# EAGLE design can4vscp_rs232_rev_A (EAGLE 5.11)
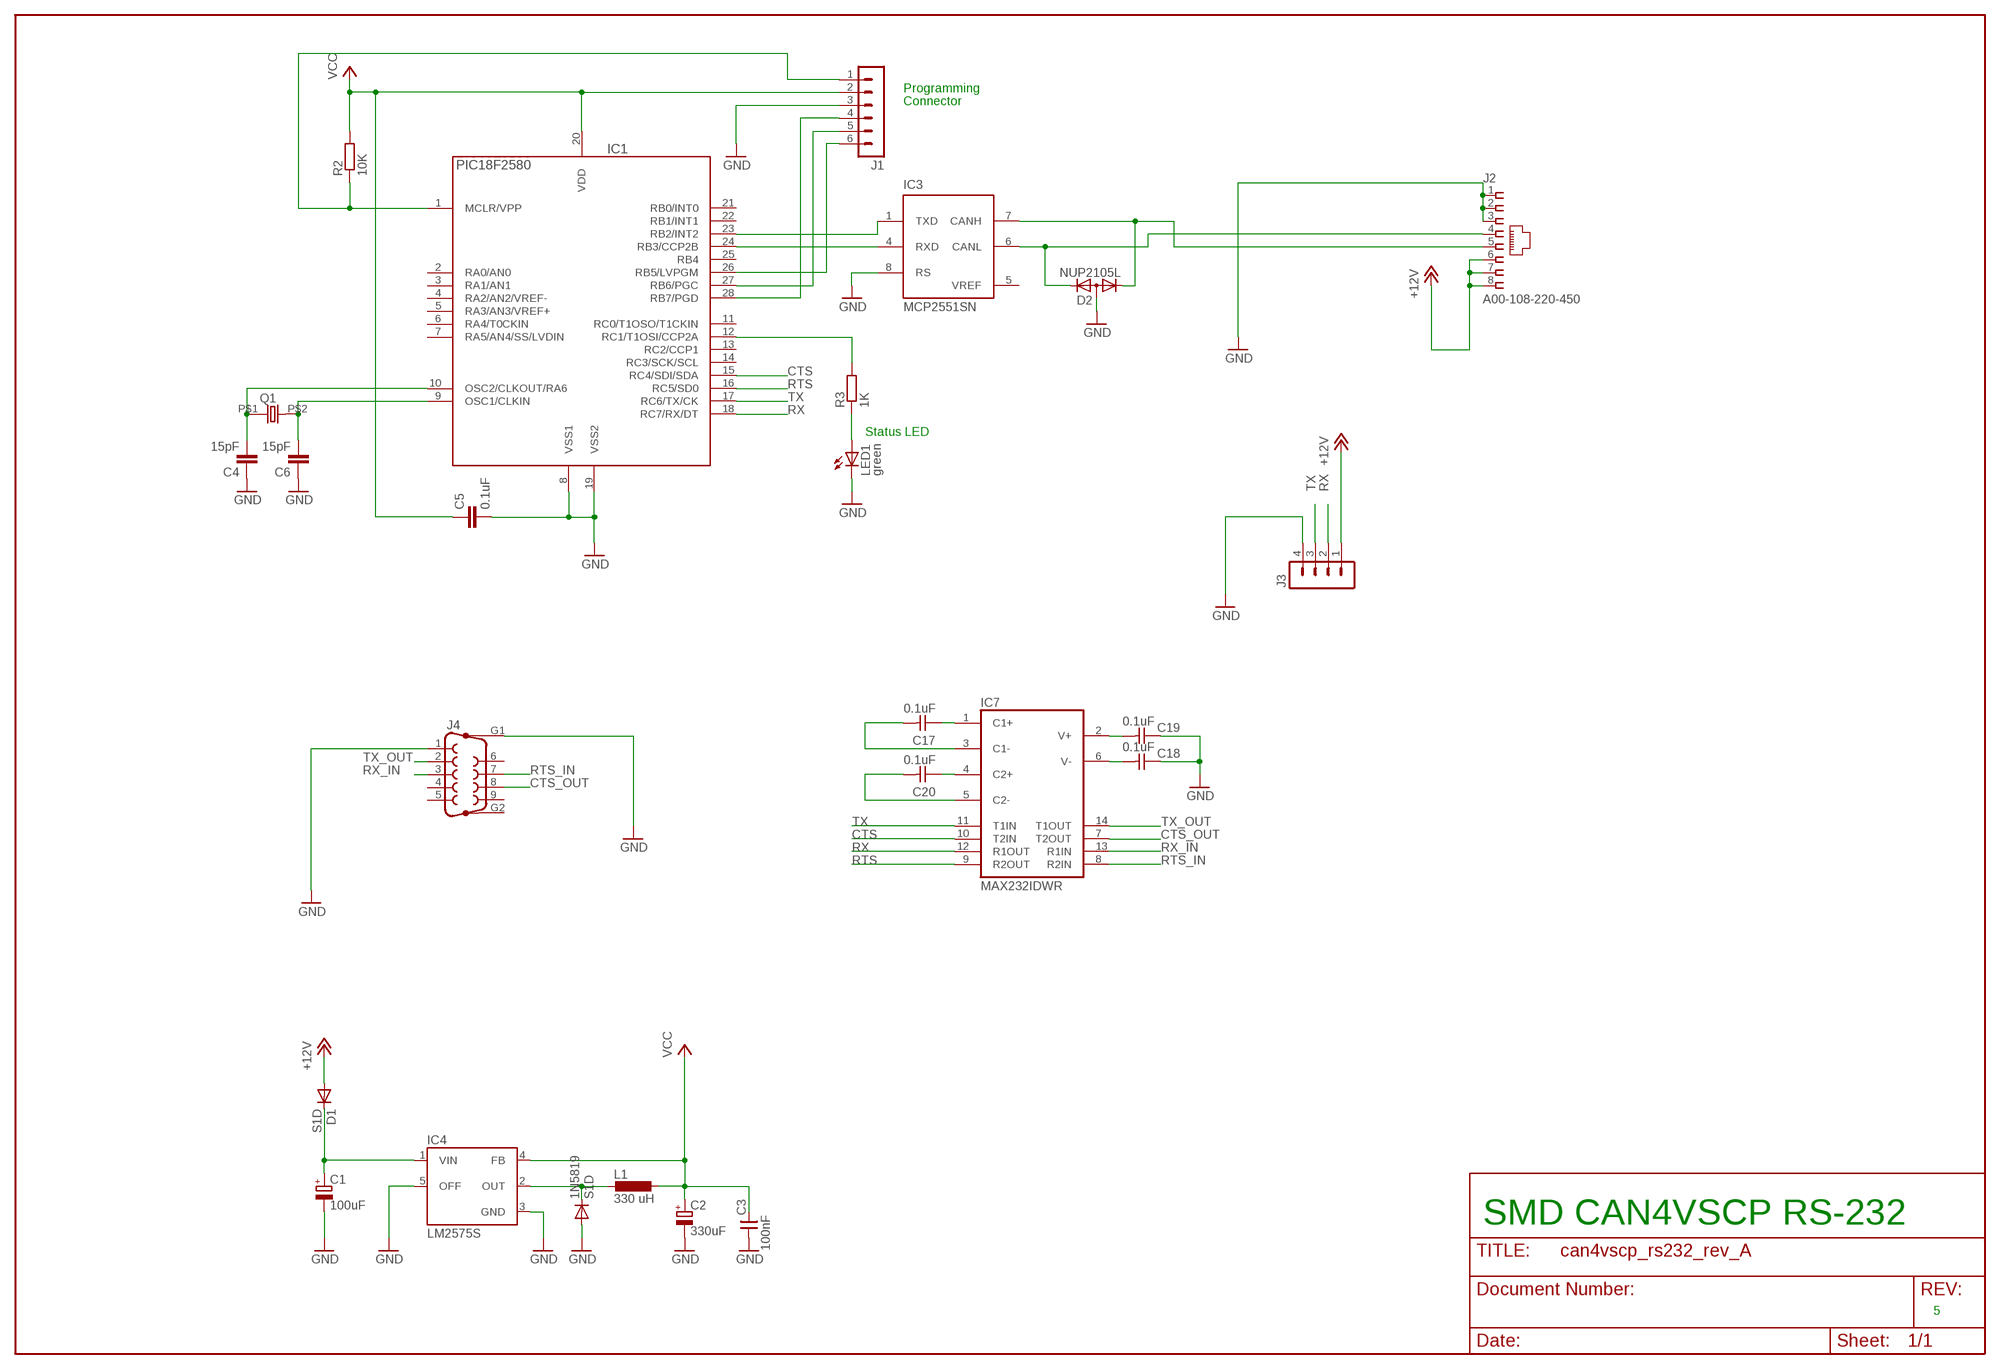
[diagram p0: schematic, sheet 1]

## Parts
1N5819  S1D  DIODE-SMB  [SMB]
C1  100uF  CPOL-EUD  [PANASONIC_D]
C2  330uF  CPOL-EUD  [PANASONIC_D]
C3  100nF  CNP-0805  [0805]
C4  15pF  C-EUC0805  [C0805]
C5  0.1uF  C-EUC0805  [C0805]
C6  15pF  C-EUC0805  [C0805]
C17  0.1uF  NP_CAP0805  [C0805]
C18  0.1uF  NP_CAP0805  [C0805]
C19  0.1uF  NP_CAP0805  [C0805]
C20  0.1uF  NP_CAP0805  [C0805]
D1  S1D  DIODE-SMB  [SMB]
D2  NUP2105L  DIODE-2CA|ACSOT23  [SOT23]
IC1  PIC18F2580  PIC18LF252-I/SO  [SO28]
IC3  MCP2551SN  [SO-08]
IC4  LM2575S  [TO263-5]
IC7  MAX232IDWR  MAX232ECWE  [SO16L]
J1  MA06-1  [MA06-1]
J2  A00-108-220-450  [RJ-45]
J3  MA04-1  [MA04-1]
J4  F09HP  [F09HP]
L1  330 uH  DO3316P  [DO3316P]
LED1  green  LEDCHIPLED_0805  [CHIPLED_0805]
Q1  HC-49S  [9C]
R2  10K  R-EU_R0805  [R0805]
R3  1K  R-EU_R0805  [R0805]

## Nets
+12V: D1.A J2.6 J2.7 J2.8 J3.1
CANH: D2.1(K1) IC3.7(CANH) J2.5
CANL: D2.2(K2) IC3.6(CANL) J2.4
CTS: IC1.15(RC4/SDI/SDA) IC7.10(T2IN)
CTS_OUT: IC7.7(T2OUT) J4.8
GND: 1N5819.A C1.- C2.- C3.1 C4.1 C5.2 C6.1 C18.1 C19.1 D2.3(A) IC1.8(VSS1) IC1.19(VSS2) IC3.8(RS) IC4.3(GND) IC4.5(OFF) J1.3 J2.1 J2.2 J2.3 J3.4 J4.1 J4.G1 LED1.C
N$1: 1N5819.C IC4.2(OUT) L1.1
N$2: C4.2 IC1.10(OSC2/CLKOUT/RA6) Q1.P$1
N$3: C1.+ D1.C IC4.1(VIN)
N$4: IC1.12(RC1/T1OSI/CCP2A) R3.2
N$5: LED1.A R3.1
N$7: C6.2 IC1.9(OSC1/CLKIN) Q1.P$2
N$12: IC1.1(MCLR/VPP) J1.1 R2.1
N$13: IC1.28(RB7/PGD) J1.4
N$14: IC1.27(RB6/PGC) J1.5
N$15: IC1.26(RB5/LVPGM) J1.6
N$19: C17.1 IC7.1(C1+)
N$21: C17.2 IC7.3(C1-)
N$22: C20.1 IC7.4(C2+)
N$23: C20.2 IC7.5(C2-)
N$28: C19.2 IC7.2(V+)
N$30: C18.2 IC7.6(V-)
RTS: IC1.16(RC5/SD0) IC7.9(R2OUT)
RTS_IN: IC7.8(R2IN) J4.7
RX: IC1.18(RC7/RX/DT) IC7.12(R1OUT) J3.2
RX_IN: IC7.13(R1IN) J4.3
RXCAN: IC1.24(RB3/CCP2B) IC3.4(RXD)
TX: IC1.17(RC6/TX/CK) IC7.11(T1IN) J3.3
TX_OUT: IC7.14(T1OUT) J4.2
TXCAN: IC1.23(RB2/INT2) IC3.1(TXD)
VCC: C2.+ C3.2 C5.1 IC1.20(VDD) IC4.4(FB) J1.2 L1.2 R2.2
Unconnected: IC1.2(RA0/AN0) IC1.3(RA1/AN1) IC1.4(RA2/AN2/VREF-) IC1.5(RA3/AN3/VREF+) IC1.6(RA4/T0CKIN) IC1.7(RA5/AN4/SS/LVDIN) IC1.11(RC0/T1OSO/T1CKIN) IC1.13(RC2/CCP1) IC1.14(RC3/SCK/SCL) IC1.21(RB0/INT0) IC1.22(RB1/INT1) IC1.25(RB4) J4.4 J4.5 J4.6 J4.9 J4.G2

## Notes on the sheet
- Programming
- Connector
- Status LED
- SMD CAN4VSCP RS-232
- 5

## Power pins joined to a net without a drawn wire
GND: IC3.2(VSS) IC7.15(GND)
VCC: IC3.3(VDD) IC7.16(VCC)
VREF: IC3.5(VREF)

## Library data of the parts
1N5819 D1 = diode:DIODE-: DIODE
C1 C2 = rcl:CPOL-EU: POLARIZED CAPACITOR, European symbol
C3 = cap-master:CNP-: NON-POLARIZED CAP
C4-C6 = rcl:C-EU: CAPACITOR, European symbol
C17-C20 = Leicester:NP_CAP0805
D2 = diode:DIODE-2CA|AC: Dual DIODE Cathode-Anode|Anode-Cathode
IC1 = pic_olin:PIC18*F252-?: 18F252, 28 pin, 32Kb prog, 1536 data, 256 EEPROM
IC3 = microchip_can:MCP2551: High Speed CAN tranceiver
IC4 = v-reg-3:LM2575: National Semiconductor <http://www.national.com> 1.0A "Simple Switcher"(c) 52kHz, Vout 1.23-37V (HV: 57V), Vin 40V (HV: 60V), 50µA standby current
IC7 = maxim:MAX232ECWE: RS232 TRANSEIVER
J1 = con-lstb:MA06-1
J2 = vscpcan:A00-108-220-450
J3 = con-lstb:MA04-1: PIN HEADER; OC_FARNELL: unknown; OC_NEWARK: unknown
J4 = con-subd:F09HP: SUB-D
L1 = inductor-coilcraft:DO3316P: COILCRAFT
LED1 = led:LED: LED OSRAM: - CHIPLED LG R971, LG N971, LY N971, LG Q971, LY Q971, LO R971, LY R971 LH N974, LH R974 LS Q976, LO Q976, LY Q976 LO Q996 - Hyper CHIPLED LW Q18S LB Q993, LB Q99A, LB R99A - SideLED LS A670, LO A670, LY A670, LG A670, LP A670 LB A673, LV A673, LT A673, LW A673 LH A674 LY A675 LS A676, LA A676, LO A676, LY A676, LW A676 LS A679, LY A679, LG A679 - Hyper Micro SIDELED® LS Y876, LA Y876, LO Y876, LY Y876 LT Y87S - SmartLED LW L88C, LW L88S LB L89C, LB L89S, LG L890 LS L89K, LO L89K, LY L89K LS L896, LA L896, LO L896, LY L896 - TOPLED LS T670, LO T670, LY T670, LG T670, LP T670 LSG T670, LSP T670, LSY T670, LOP T670, LYG T670 LG T671, LOG T671, LSG T671 LB T673, LV T673, LT T673, LW T673 LH T674 LS T676, LA T676, LO T676, LY T676, LB T676, LH T676, LSB T676, LW T676 LB T67C, LV T67C, LT T67C, LS T67K, LO T67K, LY T67K, LW E67C LS E67B, LA E67B, LO E67B, LY E67B, LB E67C, LV E67C, LT E67C LW T67C LS T679, LY T679, LG T679 LS T770, LO T770, LY T770, LG T770, LP T770 LB T773, LV T773, LT T773, LW T773 LH T774 LS E675, LA E675, LY E675, LS T675 LS T776, LA T776, LO T776, LY T776, LB T776 LHGB T686 LT T68C, LB T68C - Hyper Mini TOPLED® LB M676 - Mini TOPLED Santana® LG M470 LS M47K, LO M47K, LY M47K Source: http://www.osram.convergy.de LUXEON: - LUMILED® LXK2-PW12-R00, LXK2-PW12-S00, LXK2-PW14-U00, LXK2-PW14-V00 LXK2-PM12-R00, LXK2-PM12-S00, LXK2-PM14-U00 LXK2-PE12-Q00, LXK2-PE12-R00, LXK2-PE12-S00, LXK2-PE14-T00, LXK2-PE14-U00 LXK2-PB12-K00, LXK2-PB12-L00, LXK2-PB12-M00, LXK2-PB14-N00, LXK2-PB14-P00, LXK2-PB14-Q00 LXK2-PR12-L00, LXK2-PR12-M00, LXK2-PR14-Q00, LXK2-PR14-R00 LXK2-PD12-Q00, LXK2-PD12-R00, LXK2-PD12-S00 LXK2-PH12-R00, LXK2-PH12-S00 LXK2-PL12-P00, LXK2-PL12-Q00, LXK2-PL12-R00 Source: www.luxeon.com KINGBRIGHT: KA-3528ASYC Source: www.kingbright.com
Q1 = vscpcan:HC-49S: Digikey 887-1050-1-nd
R2 R3 = rcl:R-EU_: RESISTOR, European symbol

## Board
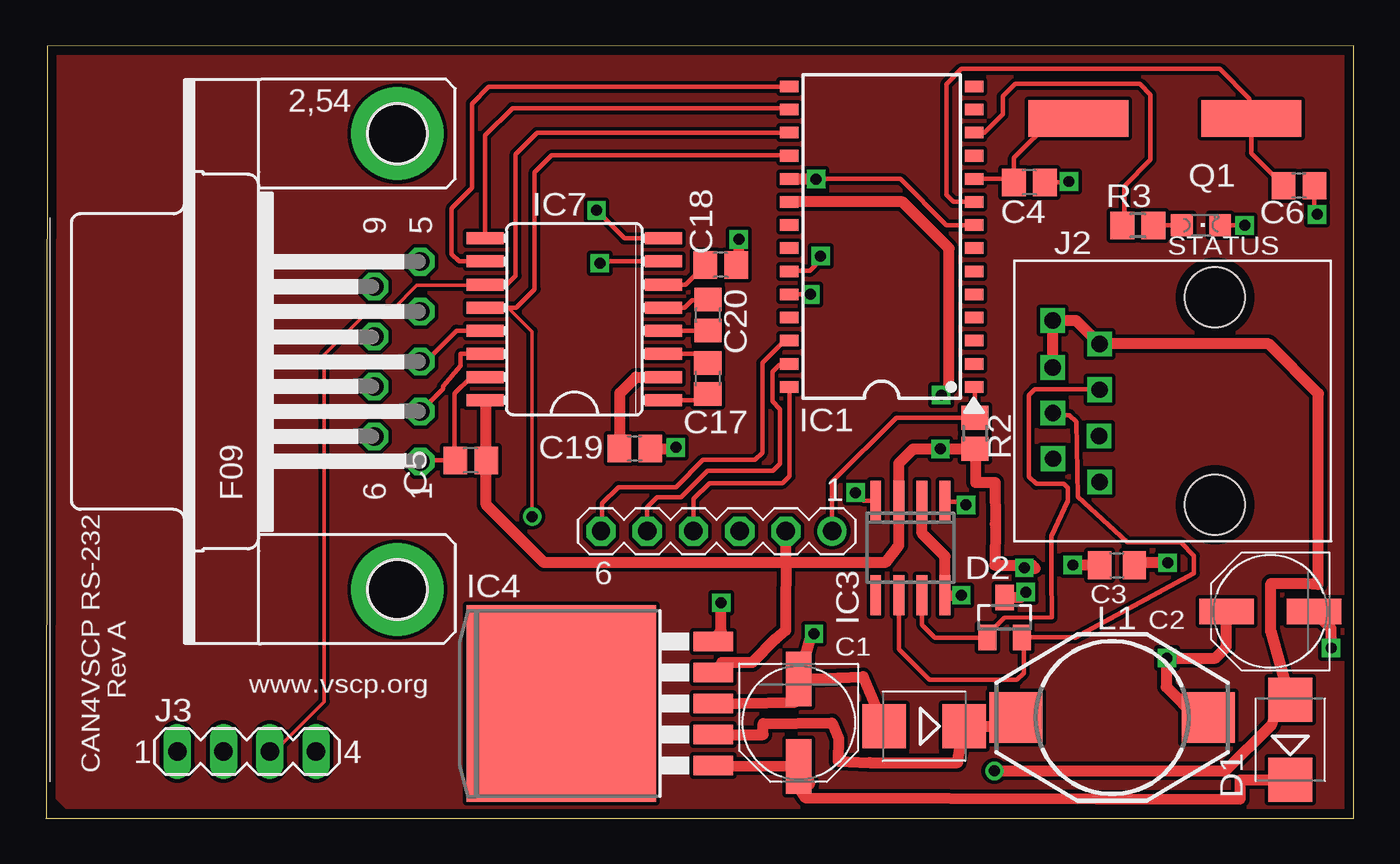
[diagram p1: board, top side]
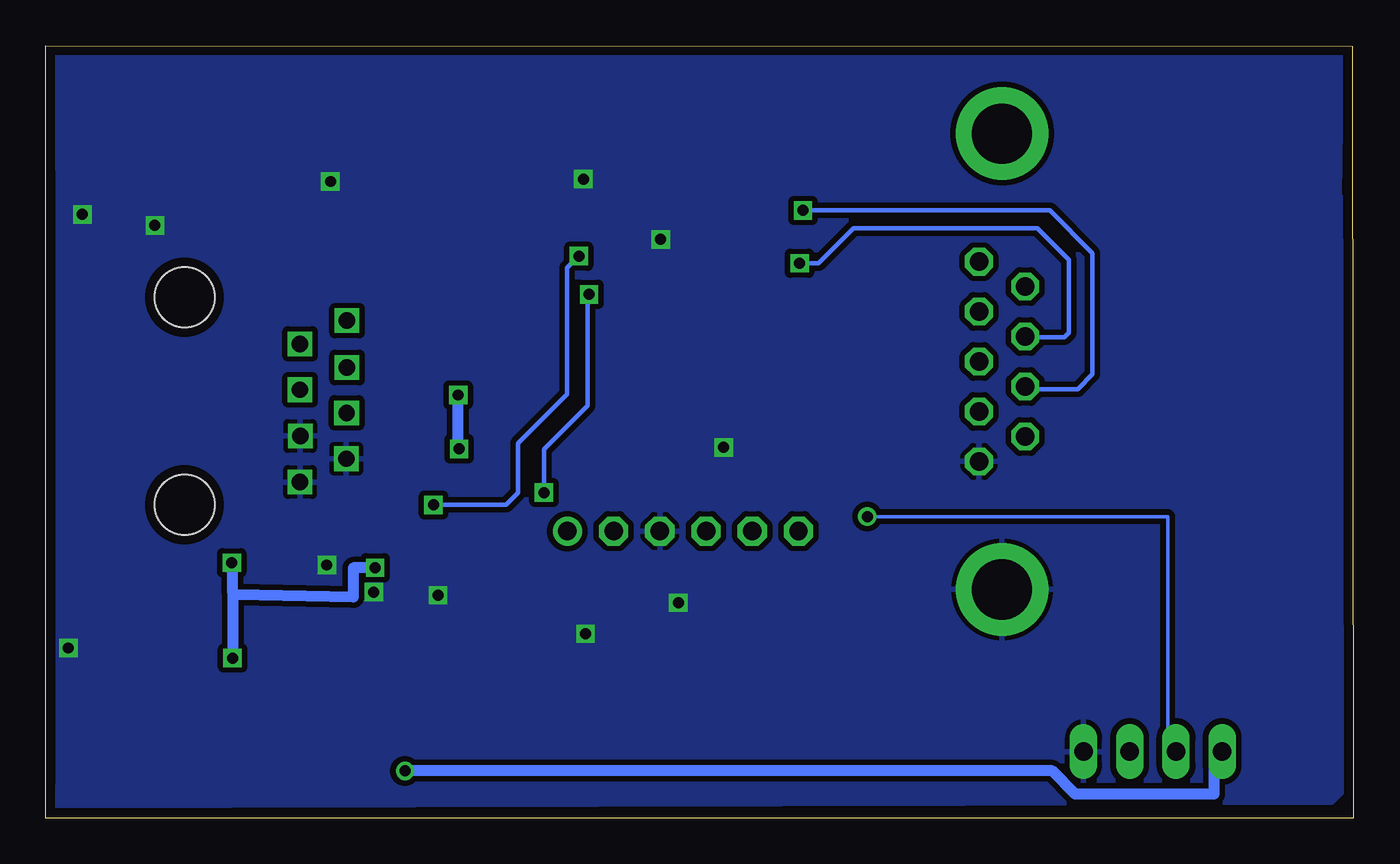
[diagram p2: board, bottom side, seen from below]

Size 71.91 x 42.44 mm. Coordinates in mm from the lower left corner, seen from the top.
Outline: 0,0 71.91,0 71.91,42.44 0.09,42.39 0.04,0.01
Copper layers (1*16): Top 0.035mm / dielectric 1.5mm / Bottom 0.035mm
Design rules "8mils": minimum track width 8mil, minimum drill 0.6mm, track to track 8mil, track to pad 8mil, pad to pad 8mil, via to via 8mil, smd to smd 0mil, copper to edge 20mil, drill to drill 10mil, minimum pad ring 8mil, minimum via ring 8mil, stop-mask expansion 0mil, vias tented up to drill 0mil, thermal gap 10mil

### Footprints (pad centres in the part's own frame; a part is rotated, then mirrored left to right if it is on the bottom)
SMB = smd 2.4 x 2.4: A 2.2,0; C -2.2,0
PANASONIC_D = smd 3 x 1.4: + 2.4,0; - -2.4,0
0805 = smd 1.27 x 1.524: 1 -0.953,0; 2 0.953,0
C0805 = smd 1.3 x 1.5: 1 -0.85,0; 2 0.85,0
SOT23 = smd 1 x 1.4: 1 -0.95,-1.1; 2 0.95,-1.1; 3 0,1.1
SO28 = smd 0.635 x 1.016: 1 -8.255,-5.08; 2 -6.985,-5.08; 3 -5.715,-5.08; 4 -4.445,-5.08; 5 -3.175,-5.08; 6 -1.905,-5.08; 7 -0.635,-5.08; 8 0.635,-5.08; 9 1.905,-5.08; 10 3.175,-5.08; 11 4.445,-5.08; 12 5.715,-5.08; 13 6.985,-5.08; 14 8.255,-5.08; 15 8.255,5.08; 16 6.985,5.08; 17 5.715,5.08; 18 4.445,5.08; 19 3.175,5.08; 20 1.905,5.08; 21 0.635,5.08; 22 -0.635,5.08; 23 -1.905,5.08; 24 -3.175,5.08; 25 -4.445,5.08; 26 -5.715,5.08; 27 -6.985,5.08; 28 -8.255,5.08
SO-08 = smd 0.6 x 2.2: 1 -1.905,-2.6; 2 -0.635,-2.6; 3 0.635,-2.6; 4 1.905,-2.6; 5 1.905,2.6; 6 0.635,2.6; 7 -0.635,2.6; 8 -1.905,2.6
TO263-5 = smd 1.067 x 2.159: 1 -3.404,-5.791; 2 -1.702,-5.791; 3 0,-5.791; 4 1.702,-5.791; 5 3.404,-5.791 | smd 10.8 x 10.41: 6 0,2.54
SO16L = smd 0.66 x 2.032: 1 -4.445,-4.902; 2 -3.175,-4.902; 3 -1.905,-4.902; 4 -0.635,-4.902; 5 0.635,-4.902; 6 1.905,-4.902; 7 3.175,-4.902; 8 4.445,-4.902; 9 4.445,4.902; 10 3.175,4.902; 11 1.905,4.902; 12 0.635,4.902; 13 -0.635,4.902; 14 -1.905,4.902; 15 -3.175,4.902; 16 -4.445,4.902
MA06-1 = drill 1.016 pad 1.6 round: 1 -6.35,0 | drill 1.016 pad 1.6 octagon: 2 -3.81,0; 3 -1.27,0; 4 1.27,0; 5 3.81,0; 6 6.35,0
RJ-45 = drill 0.9 square: 1 -4.45,6.35; 2 -3.17,8.89; 3 -1.92,6.36; 4 -0.65,8.91; 5 0.62,6.35; 6 1.84,8.93; 7 3.14,6.35; 8 4.42,8.93 | hole 3.3: -5.7,0; 5.7,0
MA04-1 = drill 1.016 long: 1 -3.81,0; 2 -1.27,0; 3 1.27,0; 4 3.81,0
F09HP = drill 1.016 octagon: 1 -5.486,-1.27; 2 -2.743,-1.27; 3 0,-1.27; 4 2.743,-1.27; 5 5.486,-1.27; 6 -4.115,1.27; 7 -1.372,1.27; 8 1.372,1.27; 9 4.115,1.27 | drill 3.302 pad 5.08 round: G1 -12.522,0; G2 12.522,0
DO3316P = smd 2.92 x 2.79: 1 -5.28,0; 2 5.28,0
CHIPLED_0805 = smd 1.2 x 1.2: A 0,-1.05; C 0,1.05
9C = smd 5.5 x 2: P$1 -4.74,0; P$2 4.76,0
R0805 = smd 1.3 x 1.5: 1 -0.85,0; 2 0.85,0

### Placement (x,y rotation side)
1N5819  48.28,5.04 180 top
C1  41.39,5.23 270 top
C2  67.31,11.35 180 top
C3  58.88,13.89 0 top
C4  54.07,34.92 180 top
C5  23.37,19.65 180 top
C6  68.89,34.74 180 top
C17  36.4,24.14 90 top
C18  37.11,30.39 180 top
C19  32.38,20.3 180 top
C20  36.41,27.63 90 top
D1  68.41,4.3 90 top
D2  52.71,11.02 0 top
IC1  45.95,31.94 90 top
IC3  47.53,14.84 180 top
IC4  30.9,6.28 90 top
IC7  29.07,27.4 90 top
J1  36.88,15.76 180 top
J2  64.27,22.91 90 top
J3  11.06,3.65 0 top
J4  19.34,25.08 90 top
L1  58.62,5.52 0 top
LED1  63.5,32.57 270 top
Q1  61.5,38.44 0 top
R2  51.08,21.14 270 top
R3  60.03,32.56 180 top

### Tracks (layer width: path | path; a pad name or v marks a point on that pad's centre or on a via)
+12V  (via drill 0.6)
  Top 0.61: J2.6 J2.8 56.64,27.33 J2.7 67.22,26.05 69.96,23.31 69.94,12.84 69.22,12.89 67.35,12.89 67.35,10.19 67.36,10.24 D1.A 67.81,6.19 67.39,5.13 64.85,2.59 v52.15,2.59
  Bottom 0.203: J3.1 7.7,3.86
  Bottom 0.61: 7.7,3.86 7.7,1.32 15.32,1.32 16.59,2.59 v52.15,2.59
CANH
  Top 0.254: IC3.7 48.16,10.62 48.88,9.91 D2.1 51.76,10.07 52.69,11 55.3,11.03 55.29,13.38 55.28,15.48 56.18,17.44 56.18,18.14 55.96,18.36 54.45,18.36 54.05,18.76 54.05,23.24 54.37,23.56 57.89,23.56 J2.5
CANL
  Top 0.254: IC3.6 46.89,9.29 48.59,7.59 53.39,7.59 53.76,7.96 53.76,9.81 53.74,9.99 53.68,9.96 D2.2 56.57,9.92 56.58,9.91 63.11,13.46 63.11,14.4 62.42,15.12 59.45,15.16 56.73,17.64 56.65,21.76 56.28,22.13 55.49,22.13 J2.4
CTS
  Top 0.254: IC7.10 22.73,30.57 22.33,30.98 22.33,33.51 23.44,34.62 23.44,39.25 24.36,40.17 40.84,40.17 IC1.15
CTS_OUT  (via drill 0.6)
  Top 0.254: IC7.7 30.56,30.57 v30.47,30.48
  Bottom 0.254: v30.47,30.48 29.43,30.48 27.51,32.4 17.4,32.4 15.67,30.67 15.67,26.66 15.92,26.41 18.03,26.41 J4.8
GND  (via drill 0.6)
  Top 0.254: IC7.15 23.38,24.23 22.49,23.33 22.49,19.68 C5.2 20.67,19.65 J4.1 | 34.58,20.3 v34.64,20.36 | C18.1 38.1,30.53 | 42.34,35.11 v42.35,35.1 v42.36,35.11 46.98,35.11 49.52,32.57 IC1.8 | C6.1 69.74,33.3 v69.88,33.16 | C4.1 56.2,34.92 v56.25,34.97 | LED1.C v65.89,32.57 v65.9,32.56
  Top 0.61: IC4.3 41.2,6.37 C1.- | C1.- 44.93,7.76 1N5819.A | C1.- 42.12,10.14 v42.23,10.12 | v37.13,11.83 37.13,10.29 IC4.5 | C3.1 v56.46,13.89 v56.45,13.9 | IC3.2 48.16,15.65 49.44,14.37 IC3.8 | IC3.8 | v70.65,9.34 70.65,10.4 C2.- | IC3.8 50.32,12.2 v50.33,12.24 | D2.3 53.58,12.12 v53.87,12.41 | C19.1 34.58,20.3 | 38.1,30.53 v38.1,31.79 | IC1.19 42.34,35.11
  pour Bottom (isolate 0.305): 0.67,34.09 0.67,1.45 1.26,0.86 71.71,0.67 71.21,1.83 71.21,34.32 71.3,41.86 0.69,41.86 0.82,34.17
N$1
  Top 0.61: 54.37,6.05 L1.1 52.86,5.04 1N5819.C 50.12,3.05 45.29,3.05 43.55,3.13 43.59,4.38 43.21,5.23 39.43,5.19 39.43,4.58 IC4.2
N$2
  Top 0.254: Q1.P$1 56.68,38.36 55.32,38.36 53.22,36.26 C4.2 53.03,35.11 IC1.10
N$3
  Top 0.61: IC4.1 37.61,2.88 C1.+ 41.46,2.82 42.01,1.9 41.89,1.78 41.31,1.78 41.75,1.12 65.65,1.04 65.65,2.1 D1.C
N$4
  Top 0.254: IC1.12 51.6,37.65 52.61,38.66 52.61,39.65 53.29,40.33 60.13,40.33 60.73,39.73 60.73,36.17 59.28,34.72 59.28,32.66 R3.2
N$5
  Top 0.254: R3.1 LED1.A
N$6
  pour Top: 0.61,41.87 0.38,41.87 0.38,1.41 1.44,0.35 71.07,0.35 71.6,0.88 71.6,41.94 71.29,42.25
N$7
  Top 0.254: C6.2 66.26,36.52 Q1.P$2 66.59,38.11 66.59,37.98 66.16,38.41 66.16,39.52 64.53,41.15 50.34,41.15 49.5,40.31 49.5,34.23 49.88,33.84 IC1.9
N$12
  Top 0.254: J1.1 43.23,18.48 46.75,22 R2.1 51.08,23.64 IC1.1
N$13
  Top 0.254: J1.4 35.61,17.53 36.48,18.4 40.51,18.4 40.89,18.78 40.89,23.66 IC1.28
N$14
  Top 0.254: J1.5 33.07,17.08 33.61,17.62 34.93,17.62 36.39,19.08 39.98,19.08 40.37,19.47 40.37,22.47 39.94,22.9 39.94,24.52 40.33,24.91 40.82,24.91 IC1.27
N$15
  Top 0.254: IC1.26 40.61,26.23 39.39,25 39.39,20.07 39,19.68 36.14,19.68 34.64,18.18 31.48,18.18 30.58,17.28 30.58,15.81 J1.6
N$19
  Top 0.254: IC7.1 36.06,22.96 C17.1
N$21
  Top 0.254: IC7.3 35.89,25.5 C17.2
N$22
  Top 0.254: IC7.4 36.39,26.77 C20.1
N$23
  Top 0.254: IC7.5 35.1,28.04 35.52,28.45 36.38,28.45 C20.2
N$28
  Top 0.254: C19.2 31.57,20.34
  Top 0.61: IC7.2 32.45,24.23 31.57,23.35 31.57,20.34
N$30
  Top 0.254: IC7.6 35.17,29.3 C18.2
RTS
  Top 0.254: IC7.9 24.17,37.51 25.66,39 40.8,39 IC1.16
RTS_IN  (via drill 0.6)
  Top 0.254: IC7.8 31.81,31.85 v30.28,33.38
  Bottom 0.254: v30.28,33.38 16.72,33.38 14.38,31.04 14.38,24.37 15.18,23.57 17.93,23.57 J4.7
RX  (via drill 0.6)
  Top 0.203: v26.75,16.56 26.75,26.72 25.48,27.99 25.48,28.04
  Top 0.254: IC7.12 25.48,28.04 25.86,28.04 26.89,29.06 26.89,35.48 27.82,36.41 40.84,36.41 IC1.18
  Bottom 0.203: v26.75,16.56 10.24,16.56 10.24,3.86 J3.2
RX_IN
  Top 0.254: J4.3 20.88,25.08 22.58,26.78 24.15,26.78 IC7.13
RXCAN  (via drill 0.6)
  Top 0.254: IC3.4 44.96,17.44 v44.52,17.88 | v42.04,28.77 IC1.24
  Bottom 0.254: v44.52,17.88 44.52,20.25 42.13,22.64 42.13,28.68 v42.04,28.77
TX
  Top 0.203: J3.3 12.78,3.86 15.32,6.4 15.32,25.45 17.86,27.99 19.13,27.99 20.4,29.26 24.21,29.26 IC7.11
  Top 0.254: IC7.11 25.34,29.3 25.84,29.8 25.84,36.47 27.01,37.64 40.85,37.64 IC1.17
TX_OUT
  Top 0.254: IC7.14 22.82,25.5 22.82,24.86 21.85,23.71 21.85,23.58 J4.2
TXCAN  (via drill 0.6)
  Top 0.254: IC3.1 49.54,17.44 49.61,17.37 50.42,17.37 v50.59,17.2 | v42.6,30.87 42.6,30.66 42,30.06 40.89,30.06 IC1.23
  Bottom 0.254: v50.59,17.2 46.61,17.2 45.93,17.88 45.93,20.59 43.24,23.28 43.24,30.23 v42.6,30.87
VCC  (via drill 0.6)
  Top 0.254: 24.22,22.9 IC7.16 | 40.62,14.04 40.69,14.11
  Top 0.61: 40.69,14.11 40.67,11.36 40.67,10.31 40.13,9.84 38.83,8.54 37.18,8.54 IC4.4 | 40.69,14.11 J1.2 | v61.67,14.02 59.96,14.02 C3.2 | L1.2 63.28,5.52 61.59,7.21 61.59,8.75 v61.63,8.79 64.29,8.79 64.89,9.39 64.89,11.33 C2.+ | v53.8,13.75 53.89,13.75 54.39,13.72 54.21,13.9 52.17,13.9 52.19,16.15 52.18,18.4 52.18,18.44 51.11,18.44 51.11,20.29 R2.2 v49.18,20.28 47.69,20.28 46.89,19.48 IC3.3 46.89,14.99 46.19,14.06 40.86,14.06 40.69,14.11 | IC1.20 47.1,33.84 49.65,31.3 49.65,23.66 v49.23,23.24 | 24.22,22.9 C5.1 24.22,17.2 27.38,14.04 40.62,14.04
  Bottom 0.61: 61.63,12.44 v61.63,8.79 | 61.63,12.44 61.63,13.98 v61.67,14.02 | v53.8,13.75 55,13.75 55,12.13 61.46,12.27 61.63,12.44 | v49.23,23.24 49.23,20.33 v49.18,20.28

### Text on the board
tNames: STATUS | Rev A | www.vscp.org | CAN4VSCP RS-232